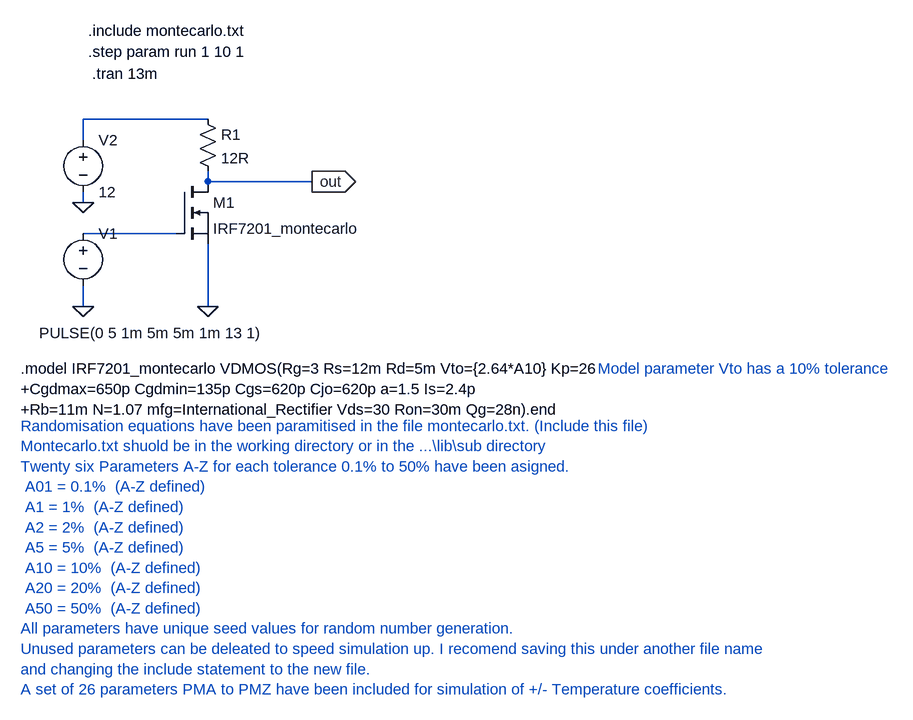
[diagram p0: schematic Montecarlo_mosfet.asc]
Montecarlo_mosfet.asc, the LTspice schematic file:
Version 4
SHEET 1 1492 876
WIRE 128 240 128 336
WIRE -64 224 80 224
WIRE -64 304 -64 336
WIRE -64 176 -64 160
WIRE -64 80 -64 48
WIRE -64 48 128 48
WIRE 128 128 128 144
WIRE 288 144 128 144
FLAG 128 336 0
FLAG -64 336 0
FLAG -64 176 0
FLAG 288 144 out
IOPIN 288 144 Out
SYMBOL nmos 80 144 R0
SYMATTR InstName M1
SYMATTR Value IRF7201_montecarlo
SYMBOL voltage -64 208 R0
WINDOW 3 -68 169 Left 0
WINDOW 123 0 0 Left 0
WINDOW 39 0 0 Left 0
SYMATTR Value PULSE(0 5 1m 5m 5m 1m 13 1)
SYMATTR InstName V1
SYMBOL Sources\\voltage -64 64 R0
WINDOW 123 0 0 Left 0
WINDOW 39 0 0 Left 0
SYMATTR InstName V2
SYMATTR Value 12
SYMBOL res 112 32 R0
SYMATTR InstName R1
SYMATTR Value 12R
TEXT -160 432 Left 0 !.model IRF7201_montecarlo VDMOS(Rg=3 Rs=12m Rd=5m Vto={2.64*A10} Kp=26 \n+Cgdmax=650p Cgdmin=135p Cgs=620p Cjo=620p a=1.5 Is=2.4p \n+Rb=11m N=1.07 mfg=International_Rectifier Vds=30 Ron=30m Qg=28n).end
TEXT -50 -22 Left 0 !.tran 13m
TEXT -56 -88 Left 0 !.include montecarlo.txt
TEXT -56 -56 Left 0 !.step param run 1 10 1
TEXT -160 520 Left 0 ;Randomisation equations have been paramitised in the file montecarlo.txt. (Include this file)\nMontecarlo.txt shuold be in the working directory or in the ...\\lib\\sub directory\nTwenty six Parameters A-Z for each tolerance 0.1% to 50% have been asigned.\n A01 = 0.1%  (A-Z defined)\n A1 = 1%  (A-Z defined)\n A2 = 2%  (A-Z defined)\n A5 = 5%  (A-Z defined)\n A10 = 10%  (A-Z defined)\n A20 = 20%  (A-Z defined)\n A50 = 50%  (A-Z defined)\nAll parameters have unique seed values for random number generation.\nUnused parameters can be deleated to speed simulation up. I recomend saving this under another file name \nand changing the include statement to the new file.\nA set of 26 parameters PMA to PMZ have been included for simulation of +/- Temperature coefficients.
TEXT 728 432 Left 0 ;Model parameter Vto has a 10% tolerance

The netlist it stands for:
* Montecarlo_mosfet.asc
M1 out N001 0 0 IRF7201_montecarlo
V1 N001 0 PULSE(0 5 1m 5m 5m 1m 13 1)
V2 N002 0 12
R1 N002 out 12R
.model NMOS NMOS
.model PMOS PMOS
.lib standard.mos
.model IRF7201_montecarlo VDMOS(Rg=3 Rs=12m Rd=5m Vto={2.64*A10} Kp=26
+Cgdmax=650p Cgdmin=135p Cgs=620p Cjo=620p a=1.5 Is=2.4p
+Rb=11m N=1.07 mfg=International_Rectifier Vds=30 Ron=30m Qg=28n).end
.tran 13m
.include montecarlo.txt
.step param run 1 10 1
* Randomisation equations have been paramitised in the file montecarlo.txt. (Include this file)
* Montecarlo.txt shuold be in the working directory or in the ...\lib\sub directory
* Twenty six Parameters A-Z for each tolerance 0.1% to 50% have been asigned.
*  A01 = 0.1%  (A-Z defined)
*  A1 = 1%  (A-Z defined)
*  A2 = 2%  (A-Z defined)
*  A5 = 5%  (A-Z defined)
*  A10 = 10%  (A-Z defined)
*  A20 = 20%  (A-Z defined)
*  A50 = 50%  (A-Z defined)
* All parameters have unique seed values for random number generation.
* Unused parameters can be deleated to speed simulation up. I recomend saving this under another file name
* and changing the include statement to the new file.
* A set of 26 parameters PMA to PMZ have been included for simulation of +/- Temperature coefficients.
* Model parameter Vto has a 10% tolerance
.backanno
.end